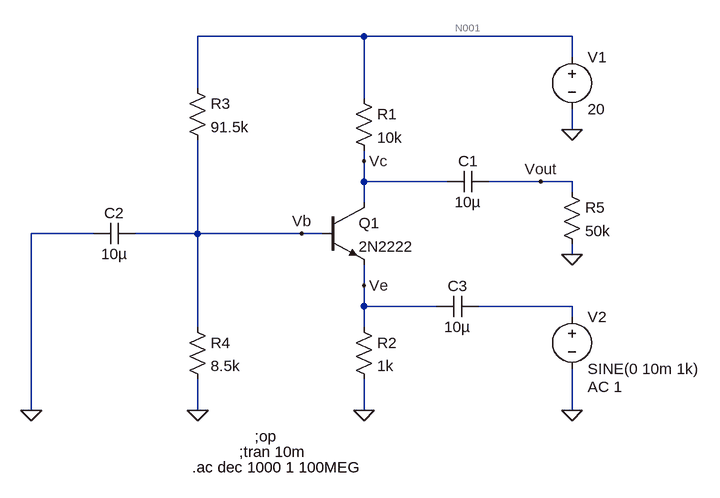
[diagram p0: schematic CB Amplifier.asc]
CB Amplifier.asc, the LTspice schematic file:
Version 4
SHEET 1 880 680
WIRE 256 -112 0 -112
WIRE 576 -112 256 -112
WIRE 576 -80 576 -112
WIRE 0 -32 0 -112
WIRE 256 -16 256 -112
WIRE 576 32 576 0
WIRE 256 80 256 64
WIRE 256 112 256 80
WIRE 384 112 256 112
WIRE 528 112 448 112
WIRE 576 112 528 112
WIRE 576 128 576 112
WIRE 256 144 256 112
WIRE -160 192 -256 192
WIRE 0 192 0 48
WIRE 0 192 -96 192
WIRE 160 192 0 192
WIRE 192 192 160 192
WIRE 576 224 576 208
WIRE 256 272 256 240
WIRE 256 304 256 272
WIRE 368 304 256 304
WIRE 576 304 432 304
WIRE 576 320 576 304
WIRE 0 336 0 192
WIRE 256 336 256 304
WIRE -256 464 -256 192
WIRE 0 464 0 416
WIRE 256 464 256 416
WIRE 576 464 576 400
FLAG 576 32 0
FLAG 256 464 0
FLAG 0 464 0
FLAG 576 224 0
FLAG -256 464 0
FLAG 528 112 Vout
FLAG 576 464 0
FLAG 160 192 Vb
FLAG 256 80 Vc
FLAG 256 272 Ve
SYMBOL res 240 -32 R0
SYMATTR InstName R1
SYMATTR Value 10k
SYMBOL res 240 320 R0
SYMATTR InstName R2
SYMATTR Value 1k
SYMBOL res -16 -48 R0
SYMATTR InstName R3
SYMATTR Value 91.5k
SYMBOL res -16 320 R0
SYMATTR InstName R4
SYMATTR Value 8.5k
SYMBOL voltage 576 -96 R0
WINDOW 123 0 0 Left 0
WINDOW 39 0 0 Left 0
SYMATTR InstName V1
SYMATTR Value 20
SYMBOL npn 192 144 R0
SYMATTR InstName Q1
SYMATTR Value 2N2222
SYMBOL res 560 112 R0
SYMATTR InstName R5
SYMATTR Value 50k
SYMBOL cap 448 96 R90
WINDOW 0 0 32 VBottom 2
WINDOW 3 32 32 VTop 2
SYMATTR InstName C1
SYMATTR Value 10µ
SYMBOL cap -96 176 R90
WINDOW 0 0 32 VBottom 2
WINDOW 3 32 32 VTop 2
SYMATTR InstName C2
SYMATTR Value 10µ
SYMBOL voltage 576 304 R0
WINDOW 123 24 124 Left 2
WINDOW 39 0 0 Left 0
SYMATTR InstName V2
SYMATTR Value SINE(0 10m 1k)
SYMATTR Value2 AC 1
SYMBOL cap 432 288 R90
WINDOW 0 0 32 VBottom 2
WINDOW 3 32 32 VTop 2
SYMATTR InstName C3
SYMATTR Value 10µ
TEXT 88 504 Left 2 !;op
TEXT 64 528 Left 2 !;tran 10m
TEXT -8 552 Left 2 !.ac dec 1000 1 100MEG

The netlist it stands for:
* CB Amplifier.asc
R1 N001 Vc 10k
R2 Ve 0 1k
R3 N001 Vb 91.5k
R4 Vb 0 8.5k
V1 N001 0 20
Q1 Vc Vb Ve 0 2N2222
R5 Vout 0 50k
C1 Vout Vc 10µ
C2 Vb 0 10µ
V2 N002 0 SINE(0 10m 1k) AC 1
C3 N002 Ve 10µ
.model NPN NPN
.model PNP PNP
.lib standard.bjt
;op
;tran 10m
.ac dec 1000 1 100MEG
.backanno
.end

* Results of the author's LTspice run, read from the files saved beside the schematic
* Operating Point, zero values left out:
*   V(n001) = 20 V
*   V(vc) = 9.944 V
*   V(ve) = 1.01 V
*   V(vb) = 1.664 V
*   Ic(Q1) = 1.006 mA
*   Ib(Q1) = 4.658 µA
*   Ie(Q1) = -1.01 mA
*   I(R4) = 195.7 µA
*   I(R3) = 200.4 µA
*   I(R2) = 1.01 mA
*   I(R1) = 1.006 mA
*   I(V1) = -1.206 mA
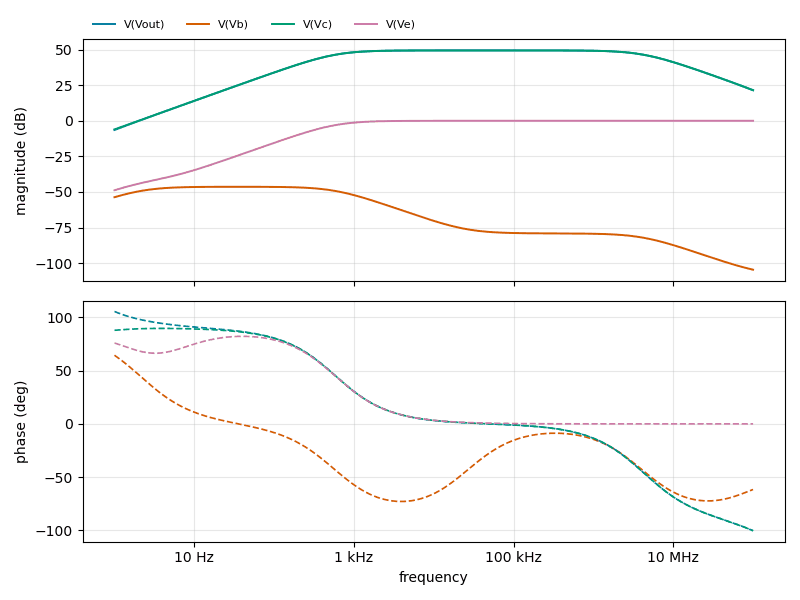
[diagram p1: AC Analysis of CB Amplifier.asc, plotted from the saved traces]
* AC Analysis, 1 run:
*   V(Vout): -6.47 dB at 1 Hz, 21.49 dB at 100 MHz, peak 49.46 dB at 49.77 kHz, 3 dB below the peak at 588.7 Hz and 4.203 MHz
*   V(Vb): -53.71 dB at 1 Hz, -104.63 dB at 100 MHz, peak -46.37 dB at 35.32 Hz, 3 dB below the peak at 2.098 Hz and 593.4 Hz
*   V(Vc): -6.05 dB at 1 Hz, 21.49 dB at 100 MHz, peak 49.46 dB at 49.77 kHz, 3 dB below the peak at 588.7 Hz and 4.203 MHz
*   V(Ve): -48.81 dB at 1 Hz, -0.00 dB at 100 MHz, peak 0.00 dB at 572.8 kHz, 3 dB below the peak at 588.9 Hz